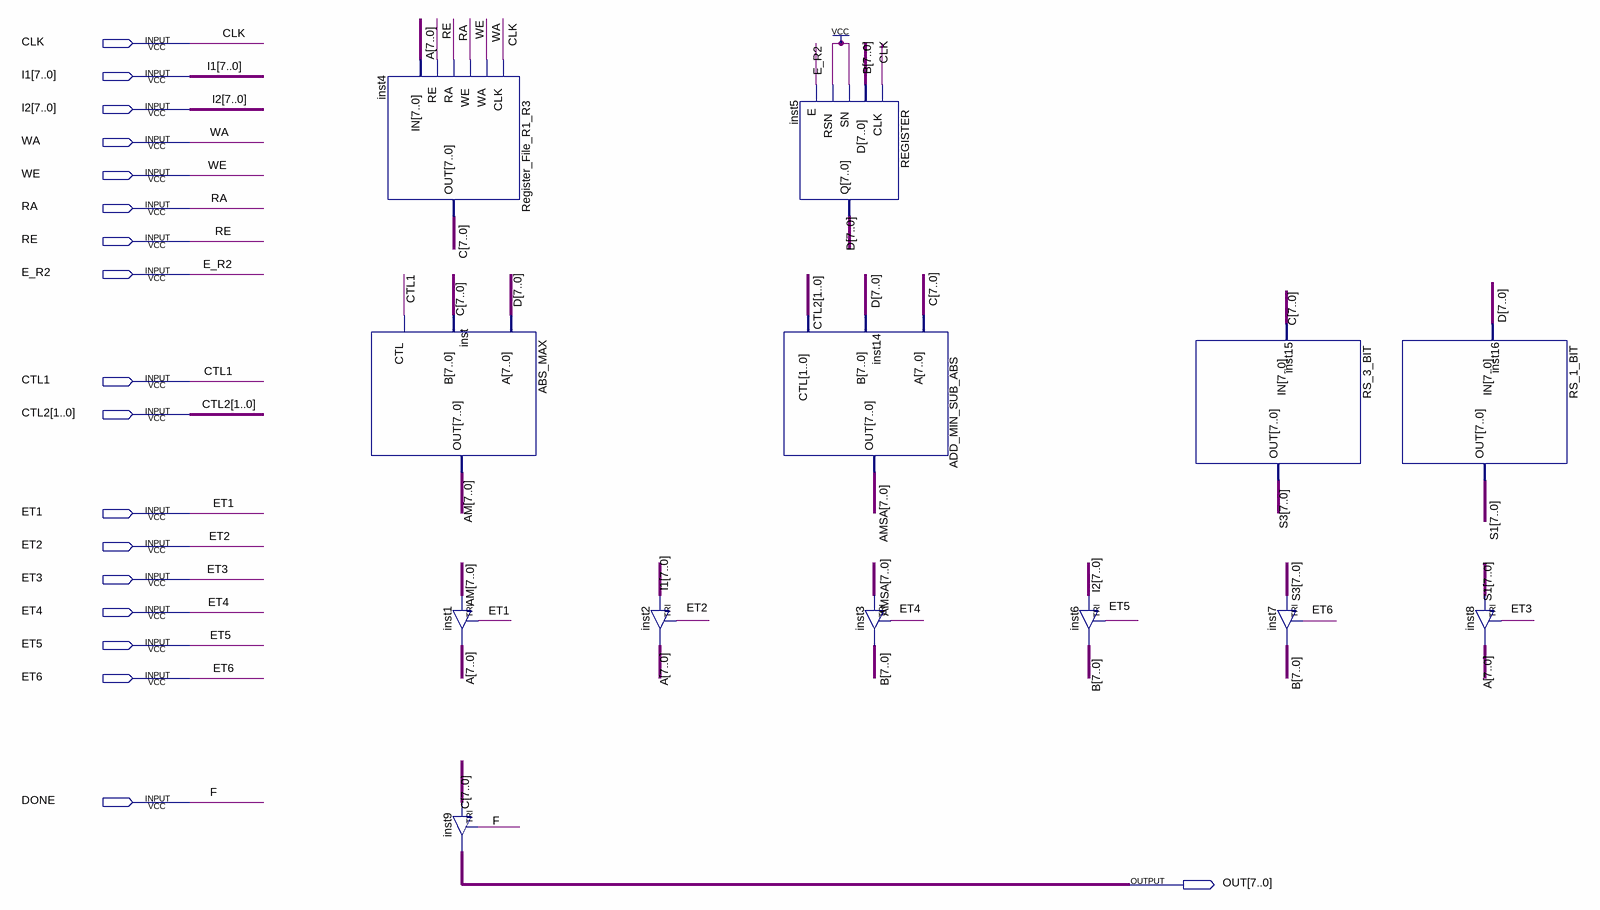
[diagram p0: schematic sheet]
// Quartus schematic Register_Merging_DATAPATH.bdf as structural Verilog: 13 symbols, 18 pins
module Register_Merging_DATAPATH (
  input  CLK,
  input  [7:0] I1,
  input  [7:0] I2,
  input  WA,
  input  WE,
  input  RA,
  input  RE,
  input  E_R2,
  input  CTL1,
  input  [1:0] CTL2,
  input  ET1,
  input  ET2,
  input  ET3,
  input  ET4,
  input  ET5,
  input  ET6,
  input  DONE,
  output [7:0] OUT
);

  wire [7:0] A, AM, AMSA, B, C, D, S1, S3;

  Register_File_R1_R3 inst4 (.CLK(CLK), .WA(WA), .WE(WE), .RA(RA), .RE(RE), .IN(A), .OUT(C));
  ABS_MAX inst (.A(D), .B(C), .CTL(CTL1), .OUT(AM));
  TRI inst1[7:0] (.IN(AM), .OE(ET1), .OUT(A));
  TRI inst9[7:0] (.IN(C), .OE(DONE), .OUT(OUT));
  TRI inst2[7:0] (.IN(I1), .OE(ET2), .OUT(A));
  REGISTER inst5 (.CLK(CLK), .D(B), .SN(1'b1), .RSN(1'b1), .E(E_R2), .Q(D));
  ADD_MIN_SUB_ABS inst14 (.A(C), .B(D), .CTL(CTL2), .OUT(AMSA));
  TRI inst3[7:0] (.IN(AMSA), .OE(ET4), .OUT(B));
  TRI inst6[7:0] (.IN(I2), .OE(ET5), .OUT(B));
  RS_3_BIT inst15 (.IN(C), .OUT(S3));
  TRI inst7[7:0] (.IN(S3), .OE(ET6), .OUT(B));
  RS_1_BIT inst16 (.IN(D), .OUT(S1));
  TRI inst8[7:0] (.IN(S1), .OE(ET3), .OUT(A));

  // Other names for the same wires on the sheet: F = DONE
endmodule
